# Altium schematic sheet power.SchDoc
size A4; SheetNumber: 6; SheetTotal: 7
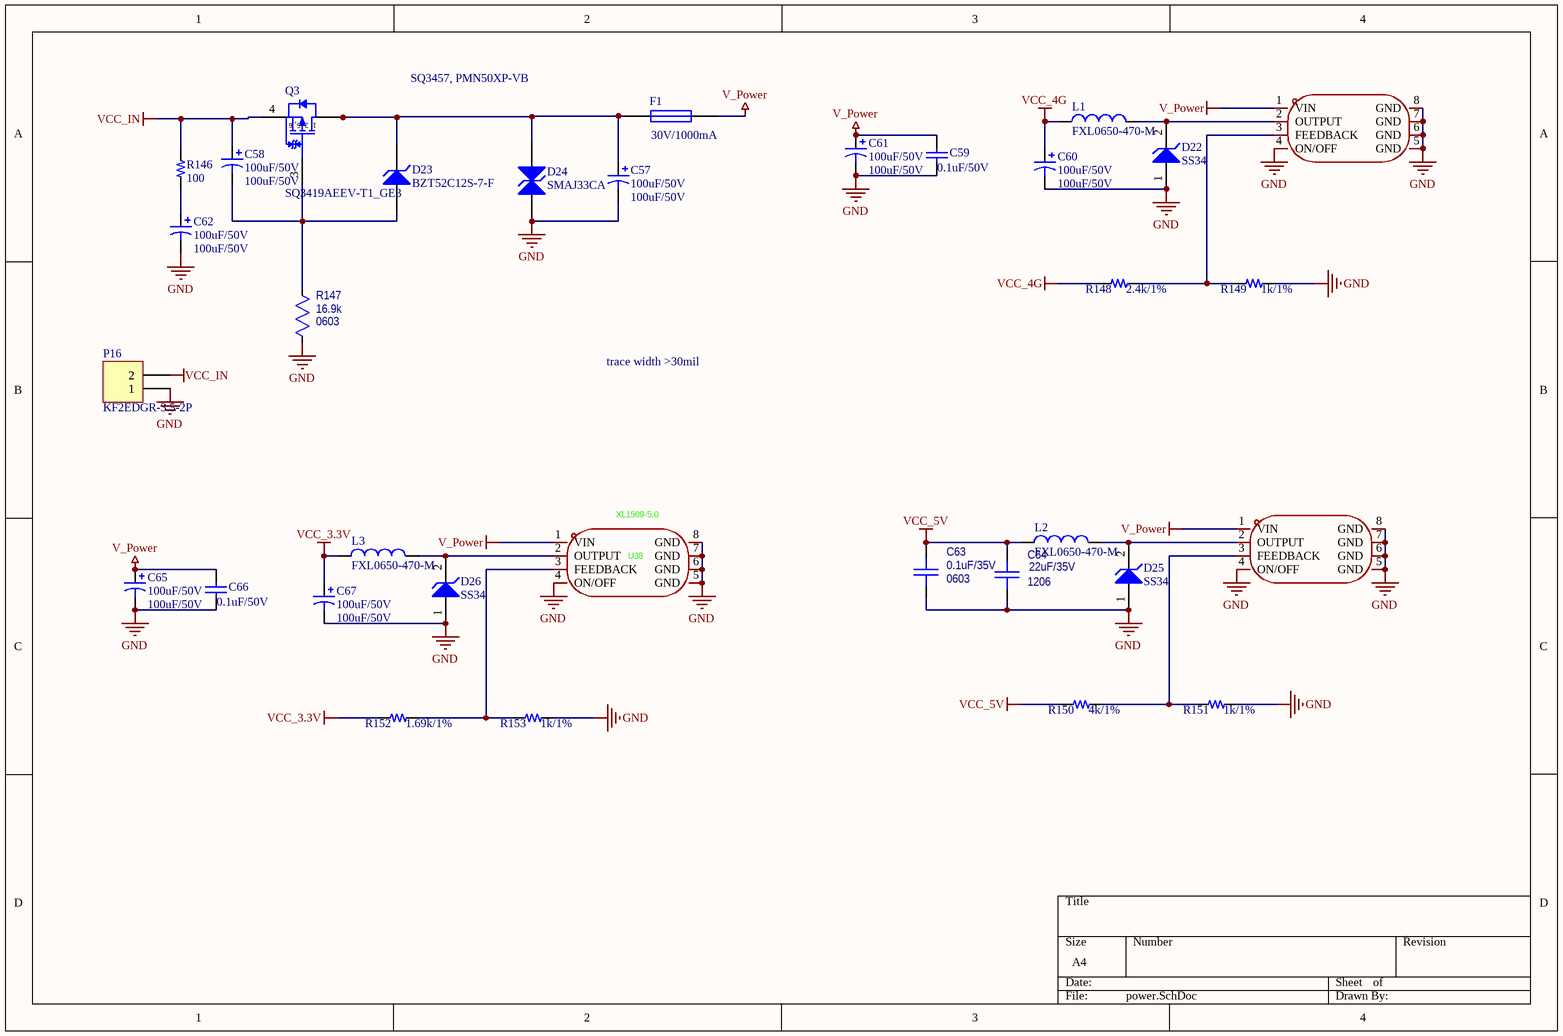
[diagram p0: power.SchDoc]

## Parts
C57  100uF/50V  [CAP-SMD_BD6.3-L6.5-W6.5-LS7.0-FD]
C58  100uF/50V  [CAP-SMD_BD6.3-L6.5-W6.5-LS7.0-FD]
C59  0.1uF/50V  [0603C]
C60  100uF/50V  [CAP-SMD_BD6.3-L6.5-W6.5-LS7.0-FD]
C61  100uF/50V  [CAP-SMD_BD6.3-L6.5-W6.5-LS7.0-FD]
C62  100uF/50V  [CAP-SMD_BD6.3-L6.5-W6.5-LS7.0-FD]
C63  Package: 0603  [CAPC3216X156N_1206]  (hidden comment: 0.1uF/35V)
C64  Package: 1206  [CAPC3216X156N_1206]  (hidden comment: 22uF/35V)
C65  100uF/50V  [CAP-SMD_BD6.3-L6.5-W6.5-LS7.0-FD]
C66  0.1uF/50V  [0603C]
C67  100uF/50V  [CAP-SMD_BD6.3-L6.5-W6.5-LS7.0-FD]
D22  SS34  [SMA]
D23  BZT52C12S-7-F  [DIOD-SOD323-2_V]
D24  SMAJ33CA  [LFUS-DO-214AC-A-2_N]
D25  SS34  [SMA]
D26  SS34  [SMA]
F1  30V/1000mA  [RESC3216X070N_1206]
L1  FXL0650-470-M  [PULS-BDCD00252012_V]
L2  FXL0650-470-M  [PULS-BDCD00252012_V]
L3  FXL0650-470-M  [PULS-BDCD00252012_V]
P16  KF2EDGR-3.5-2P  [CONN-TH_P3.50_KF2EDGR-3.5-2P]
Q3  SQ3419AEEV-T1_GE3  [VISH-TSOP-6_V]
R146  100  [RESC1608X055N_0603]
R147  value 16.9k  Package: 0603  [RESC1608X055N_0603]  (hidden comment: 16.9k/1%)
R148  2.4k/1%  [RESC1608X055N_0603]
R149  1k/1%  [RESC1608X055N_0603]
R150  4k/1%  [RESC1608X055N_0603]
R151  1k/1%  [RESC1608X055N_0603]
R152  1.69k/1%  [RESC1608X055N_0603]
R153  1k/1%  [RESC1608X055N_0603]
U36  XL1509-5.0  [so-8]  (value not drawn)
U37  XL1509-5.0  [so-8]  (value not drawn)
U38  XL1509-5.0  [so-8]

## Nets
GND: C57.2 C59.1 C60.2 C61.2 C62.2 C63.2 C64.2 C65.2 C66.1 C67.2 D22.1(A) D24.1(A) D25.1(A) D26.1(A) P16.1 R147.1 R149.1 R151.1 R153.1 U36.4(ON/OFF) U36.5(GND) U36.6(GND) U36.7(GND) U36.8(GND) U37.4(ON/OFF) U37.5(GND) U37.6(GND) U37.7(GND) U37.8(GND) U38.4(ON/OFF) U38.5(GND) U38.6(GND) U38.7(GND) U38.8(GND)
V_Power: C59.2 C61.1 C65.1 C66.2 F1.2 U36.1(VIN) U37.1(VIN) U38.1(VIN)
VCC_3.3V: C67.1 L3.1 R152.2
VCC_4G: C60.1 L1.1 R148.2
VCC_5V: C63.1 C64.1 L2.1 R150.2
VCC_IN: C58.1 P16.2 Q3.4(S) R146.1
NetC57_1: C57.1 D23.2(K) D24.2(A) F1.1 Q3.1(D) Q3.2(D) Q3.5(D) Q3.6(D)
NetC58_2: C58.2 D23.1(A) Q3.3(G) R147.2
NetC62_1: C62.1 R146.2
NetD22_2: D22.2(K) L1.2 U36.2(OUTPUT)
NetD25_2: D25.2(K) L2.2 U37.2(OUTPUT)
NetD26_2: D26.2(K) L3.2 U38.2(OUTPUT)
NetR148_1: R148.1 R149.2 U36.3(FEEDBACK)
NetR150_1: R150.1 R151.2 U37.3(FEEDBACK)
NetR152_1: R152.1 R153.2 U38.3(FEEDBACK)

## Notes on the sheet
- SQ3457, PMN50XP-VB
- trace width >30mil
- (in symbol SQ3419AEEV-T1_GE3) 1, 2, 5, 6

## Library data of the parts
C57 C58 C60-C62 C65 C67 = Cap Pol3: Polarized Capacitor (Surface Mount); Value: 100uF/50V
C59 C66 = Cap: Capacitor
C63 C64 = Capacitor_1206: PartNumber: GRM31CR61E476ME44L; Voltage Rating: [voltage]
  C63: Value: 0.1uF/35V
  C64: Value: 22uF/35V
D22 D25 D26 = FSV340AF: Schottky Barrier Rectifier, 40 V, 2-Pin SMA-FL, Pb-Free, Tape and Reel; PartNumber: B540C-13-F; Value: SS34
D23 = BZT52C12S-7-F: Zener Current: 5mA; Vz - Zener Voltage: 12V; Zz - Zener Impedance: 40Ohms; Voltage Temperature Coefficient: 0.25mV/C; Voltage Tolerance: 5%; Width: 1.4mm; Value: BZT52C12S-7-F; PartNumber: BZT52C12S
D24 = SMAJ12CA: Value: SMAJ33CA; PartNumber: SMAJ33CA
F1 = Fuse 1: PartNumber: BSMD1206-050-30V; Value: 30V/500mA
L1-L3 = BDCD002520122R2MS1: Value: FXL0650-470-M; PartNumber: BDCD002520122R2MS1
P16 = Header 2: Header, 2-Pin
Q3 = SQ3419AEEV-T1_GE3: PartNumber: PMN50XP-VB; Value: SQ3419AEEV-T1_GE3
R146 R148-R153 = R: PartNumber: RC0603FR-071KL; Package: 0603
  R146: Value: 100
  R148: Value: 2.4k/1%
  R149 R151 R153: Value: 1k/1%
  R150: Value: 4k/1%
  R152: Value: 1.69k/1%
R147 = Resistor_0603: PartNumber: FRC0603F1692TS